# EAGLE design Clock (EAGLE 8.2.1)
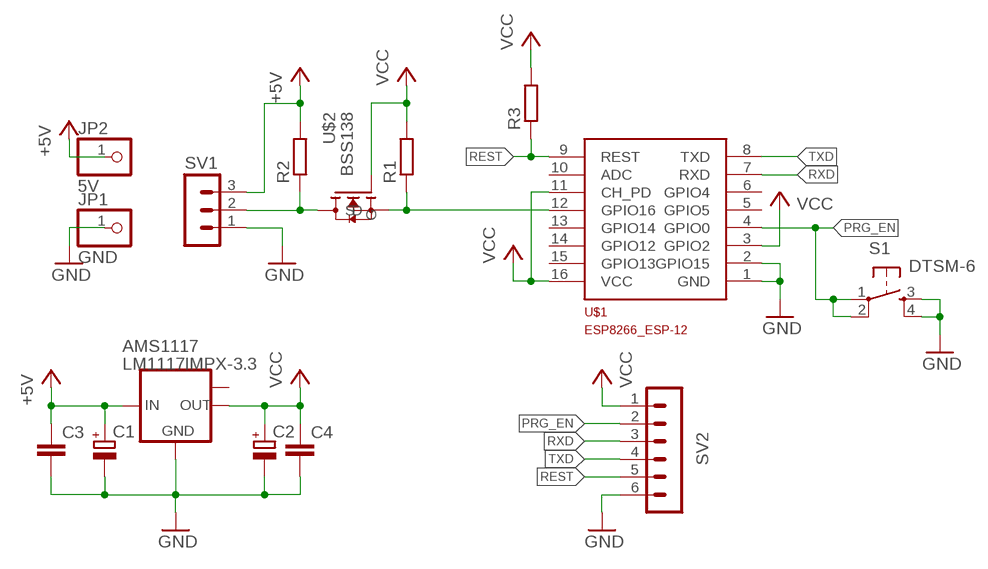
[diagram p0: schematic, sheet 1]

## Parts
AMS1117  LM1117IMPX-3.3  [SOT223]
C1  CPOL-EUE3.5-8  [E3,5-8]
C2  CPOL-EUE3.5-8  [E3,5-8]
C3  C-EUC0805  [C0805]
C4  C-EUC0805  [C0805]
JP1  GND  PINHD-1X1  [1X01]
JP2  5V  PINHD-1X1  [1X01]
R1  R-EU_R0805  [R0805]
R2  R-EU_R0805  [R0805]
R3  R-EU_R0805  [R0805]
S1  DTSM-6  [DTSM-6]
SV1  MA03-1  [MA03-1]
SV2  MA06-1  [MA06-1]
U$1  ESP8266_ESP-12  [ESP8266-ESP12]
U$2  BSS138  [BSS138]

## Nets
+5V: AMS1117.3(IN) C1.+ C3.1 JP2.1 R2.2 SV1.3
GND: AMS1117.1(GND) C1.- C2.- C3.2 C4.2 JP1.1 S1.3 S1.4 SV1.1 SV2.6 U$1.1(GND) U$1.2(GPIO15)
N$7: R2.1 SV1.2 U$2.D
N$9: R1.1 U$1.12(GPIO16) U$2.S
PRG_EN: S1.1 S1.2 SV2.2 U$1.4(GPIO0)
REST: R3.1 SV2.5 U$1.9(REST)
RXD: SV2.3 U$1.7(RXD)
TXD: SV2.4 U$1.8(TXD)
VCC: AMS1117.2(OUT) C2.+ C4.1 R1.2 R3.2 SV2.1 U$1.3(GPIO2) U$1.11(CH_PD) U$1.16(VCC) U$2.G
Unconnected: AMS1117.TAB(OUT1) U$1.5(GPIO5) U$1.6(GPIO4) U$1.10(ADC) U$1.13(GPIO14) U$1.14(GPIO12) U$1.15(GPIO13)

## Library data of the parts
AMS1117 = lm1117:LM1117IMPX-*
C1 C2 = rcl:CPOL-EU: POLARIZED CAPACITOR, European symbol
C3 C4 = rcl:C-EU: CAPACITOR, European symbol
JP1 JP2 = pinhead:PINHD-1X1: PIN HEADER
R1-R3 = rcl:R-EU_: RESISTOR, European symbol
S1 = switch-tact:DTSM-6
SV1 = con-lstb:MA03-1: PIN HEADER; OC_FARNELL: unknown; OC_NEWARK: unknown
SV2 = con-lstb:MA06-1: PIN HEADER; OC_FARNELL: unknown; OC_NEWARK: unknown
U$1 = ESP8266-ESP12:ESP8266_ESP-12
U$2 = BSS138:BSS138: BSS138 N-Channel Logic Level Enhancement Mode Field Effect Transistor; AVAILABILITY: Good; DESCRIPTION: B138 Series 50 V 6 Ohms N-Ch Logic Level Enhancement Mode FET - SOT-23-3; MF: Fairchild Semiconductor; MP: BSS138; PACKAGE: SOT-23-3 Fairchild Semiconductor; PRICE: 18.54 USD

## Board
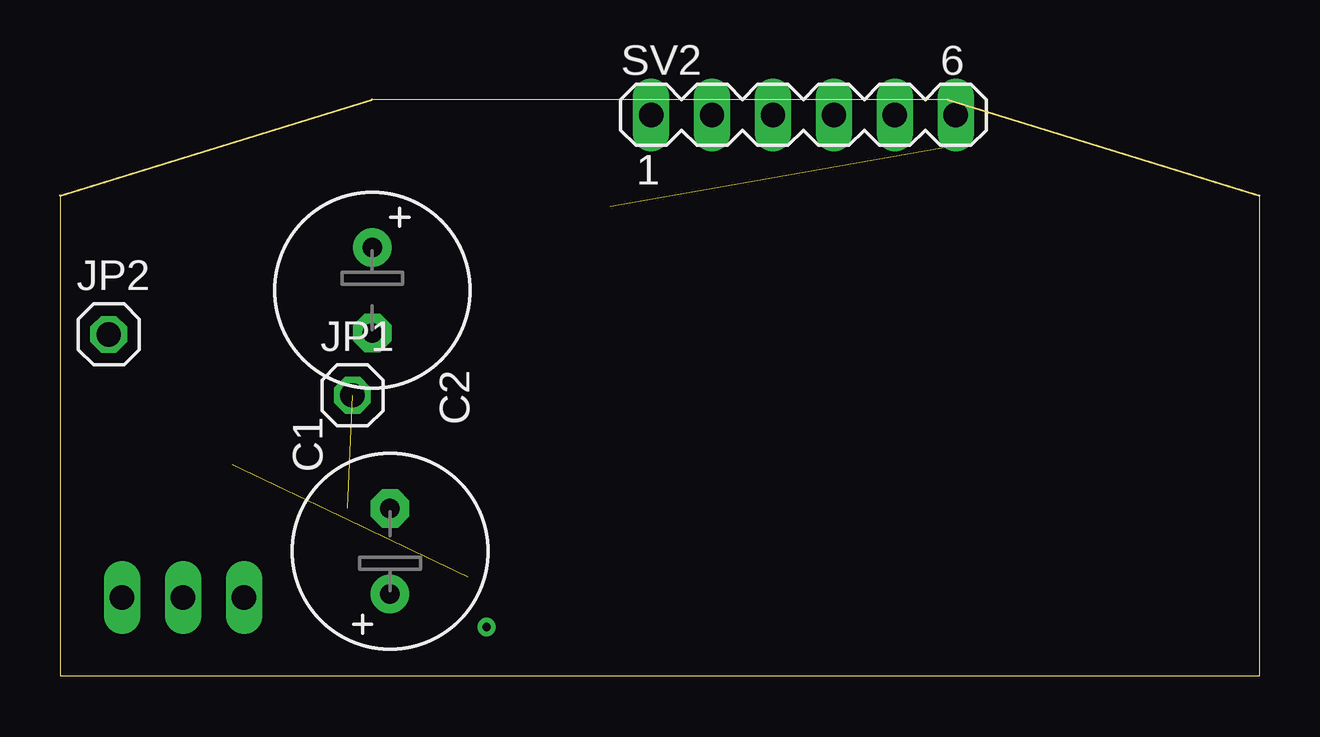
[diagram p1: board, top side]
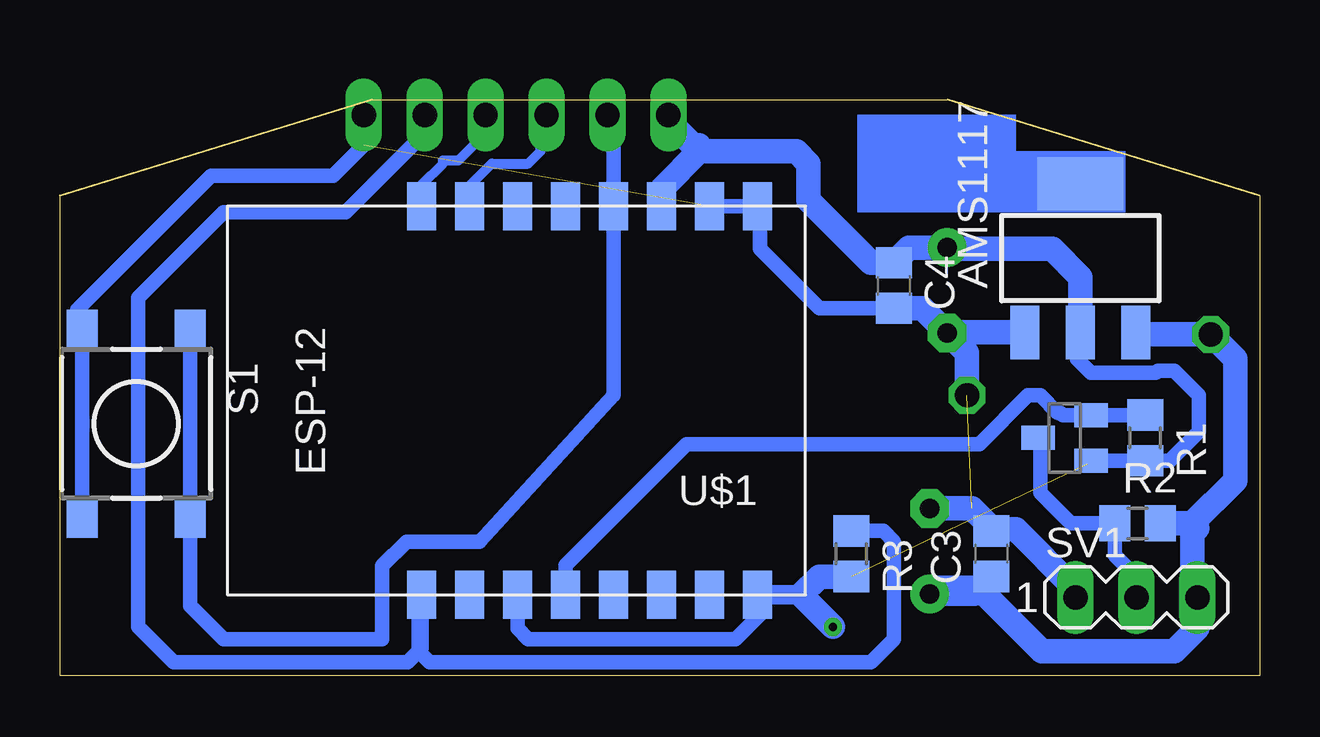
[diagram p2: board, bottom side, seen from below]

Size 50 x 24 mm. Coordinates in mm from the lower left corner, seen from the top.
Outline: 0,0 50,0 50,20 37,24 13,24 0,20 0,0
Copper layers (1*16): Top 0.035mm / dielectric 1.5mm / Bottom 0.035mm
Design rules "default *": minimum track width 6mil, minimum drill 0.35mm, track to track 10mil, track to pad 10mil, pad to pad 10mil, via to via 10mil, smd to smd 6mil, copper to edge 10mil, drill to drill 10mil, minimum pad ring 10mil, minimum via ring 8mil, stop-mask expansion 4mil, vias tented up to drill 0mil, thermal gap 10mil

### Footprints (pad centres in the part's own frame; a part is rotated, then mirrored left to right if it is on the bottom)
SOT223 = smd 1.219 x 2.235: 1 -2.311,-3.099; 2 0,-3.099; 3 2.311,-3.099 | smd 3.6 x 2.2: TAB 0,3.099
E3,5-8 = drill 0.813 pad 1.6: + -1.778,0 | drill 0.813 pad 1.6 octagon: - 1.778,0
C0805 = smd 1.3 x 1.5: 1 -0.95,0; 2 0.95,0
1X01 = drill 1.016 octagon: 1 0,0
R0805 = smd 1.3 x 1.5: 1 -0.95,0; 2 0.95,0
DTSM-6 = smd 1.55 x 1.3: 1 -3.975,2.25; 2 3.975,2.25; 3 -3.975,-2.25; 4 3.975,-2.25
MA03-1 = drill 1.016 long: 1 -2.54,0; 2 0,0; 3 2.54,0
MA06-1 = drill 1.016 long: 1 -6.35,0; 2 -3.81,0; 3 -1.27,0; 4 1.27,0; 5 3.81,0; 6 6.35,0
ESP8266-ESP12 = smd 2 x 1.2: 1 16.2,2; 2 16.2,4; 3 16.2,6; 4 16.2,8; 5 16.2,10; 6 16.2,12; 7 16.2,14; 8 16.2,16; 9 0,16; 10 0,14; 11 0,12; 12 0,10; 13 0,8; 14 0,6; 15 0,4; 16 0,2
BSS138 = smd 1 x 1.4: D 0,1.1; G -0.95,-1.1; S 0.95,-1.1
PIN1 = drill 0.6: P$1 0,0

### Placement (x,y rotation side)
AMS1117  7.47,17.4 0 bottom
C1  13.76,5.19 90 top
C2  13.02,16.06 270 top
C3  11.18,5.08 90 bottom
C4  15.24,16.26 270 bottom
JP1  12.19,11.68 0 top
JP2  2.03,14.22 0 top
R1  4.76,9.91 270 bottom
R2  5.08,6.35 0 bottom
R3  17.02,5.08 270 bottom
S1  46.82,10.5 270 bottom
SV1  5.13,3.27 0 bottom
SV2  30.99,23.37 0 top
U$1  18.93,3.36 90 bottom
U$2  8.13,9.91 90 bottom
U$3  PIN1  [PIN1]  -8.08,0 0 top  (outside the outline)

### Tracks (layer width: path | path; a pad name or v marks a point on that pad's centre or on a via)
+5V
  Bottom 0.61: 5.08,14.22 AMS1117.3
  Bottom 1.016: 2.79,6.35 1.02,8.13 1.02,13.21 JP2.1 5.08,14.22 | C3.1 11.89,3.41 C1.+ 13.5,3.67 11.72,3.67 9.07,1.02 3.56,1.02 2.59,1.98 SV1.3 2.79,3.47 2.79,6.35 | 2.59,6.14 2.79,6.35 | 2.79,6.35 R2.2
GND  (2 unrouted)
  Bottom 0.61: U$1.2 U$1.1 20.83,19.47 20.83,17.78 18.35,15.31 C4.2 | S1.4 S1.3 49.28,14.69 49.28,15.24 43.69,20.83 38.61,20.83 37.34,22.1 SV2.6
  Bottom 1.016: SV1.1 7.67,3.6 10.16,6.1 11.11,6.1 | 11.11,6.1 C3.2 | C1.- 11.98,6.97 11.11,6.1 | C2.- 14.05,15.31 C4.2 | C2.- 13,14.3 AMS1117.1 | JP1.1 12.19,13.45 C2.-
N$7
  Bottom 0.61: 6.18,6.5 R2.1 | R2.1 6.03,5.01 5.08,4.06 5.08,3.31 SV1.2 | R2.1 7.87,6.35 9.14,7.62 9.14,9.82 U$2.D
N$9
  Bottom 0.61: R1.1 U$2.S 8.19,10.86 8.3,10.96 8.43,10.96 9.14,11.68 9.65,11.68 11.68,9.65 18.29,9.65 | 18.29,9.65 18.8,9.65 | U$1.12 28.93,4.6 23.88,9.65 18.29,9.65
PRG_EN
  Bottom 0.61: 44.57,7.11 S1.1 | 44.57,7.11 S1.2 | SV2.2 26.93,23.12 U$1.4 26.92,18.55 26.92,11.68 32.51,5.59 35.56,5.59 36.58,4.57 36.58,1.52 43.18,1.52 44.57,2.91 44.57,7.11
REST
  Bottom 0.406: SV2.5 34.8,23.24 35.05,22.98
  Bottom 0.61: R3.1 15.68,6.03 15.24,5.59 15.24,1.52 16.2,0.56 34.59,0.56 35.05,1.02 35.05,2.22 U$1.9 34.93,1.14 35.51,0.56 45.26,0.56 46.74,2.03 46.74,15.75 43.18,19.3 38.1,19.3 35.05,22.35 35.05,22.98
RXD
  Bottom 0.406: U$1.7 32.93,20.41 32,21.34 30.48,21.34 29.97,21.84 29.97,23.11 SV2.3
TXD
  Bottom 0.406: U$1.8 34.93,20.45 34.04,21.34 34.04,21.46 33.4,21.46 32.26,22.61 SV2.4
VCC  (via drill 0.35)  (1 unrouted)
  Bottom 0.61: 7.18,8.81 U$2.G R1.2 3.74,8.96 2.54,10.16 2.54,11.68 3.56,12.7 4.24,12.7 4.32,12.62 7.04,12.62 7.62,13.21 7.62,14.15 AMS1117.2 | 13.33,17.78 C2.+ | U$1.11 30.93,1.97 30.48,1.52 21.84,1.52 20.83,2.54 20.93,2.64 U$1.16 20.83,3.27
  Bottom 0.813: U$1.16 19.11,3.36
  Bottom 1.016: AMS1117.2 7.47,16.61 8.64,17.78 13.33,17.78 | C2.+ 14.61,17.83 C4.1 16.19,17.21 18.8,19.81 18.8,21.34 19.3,21.84 23.37,21.84 | 23.37,21.84 24.89,20.32 24.89,19.6 U$1.3 | 23.37,21.84 23.37,22.1 | R3.2 18.35,4.13 19.11,3.36 v17.78,2.03 | SV2.1 24.64,23.11 23.37,21.84
(copper drawn outside any net)
  shapes: Bottom area x2